# Altium schematic sheet ADC.SchDoc: Analog to Digital Conversion
size B; DrawnBy: Jasper Yun; SheetNumber: 12; SheetTotal: 13; Competition: SAC 2021; Subteam: Avionics; University: McGill University; Location: Montreal, Quebec; Project: Avionics Project Name; MRT: McGill Rocket Team
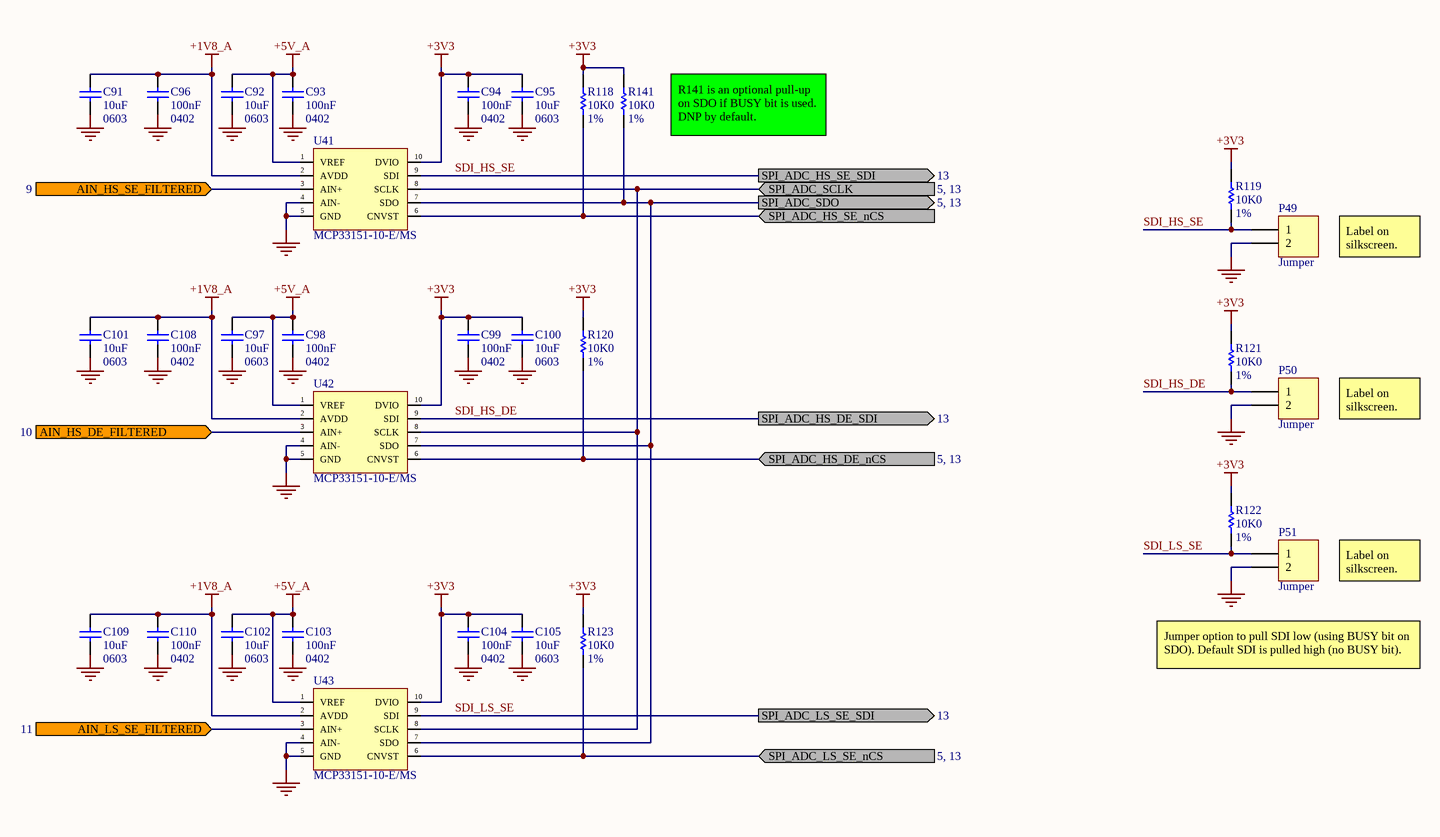
[diagram p0: ADC.SchDoc]

## Parts
C91  10uF  value 0603  [0603 CAP SAMSUNG CL10C]
C92  10uF  value 0603  [0603 CAP SAMSUNG CL10C]
C93  100nF  value 0402  [0402 CAP]
C94  100nF  value 0402  [0402 CAP]
C95  10uF  value 0603  [0603 CAP SAMSUNG CL10C]
C96  100nF  value 0402  [0402 CAP]
C97  10uF  value 0603  [0603 CAP SAMSUNG CL10C]
C98  100nF  value 0402  [0402 CAP]
C99  100nF  value 0402  [0402 CAP]
C100  10uF  value 0603  [0603 CAP SAMSUNG CL10C]
C101  10uF  value 0603  [0603 CAP SAMSUNG CL10C]
C102  10uF  value 0603  [0603 CAP SAMSUNG CL10C]
C103  100nF  value 0402  [0402 CAP]
C104  100nF  value 0402  [0402 CAP]
C105  10uF  value 0603  [0603 CAP SAMSUNG CL10C]
C108  100nF  value 0402  [0402 CAP]
C109  10uF  value 0603  [0603 CAP SAMSUNG CL10C]
C110  100nF  value 0402  [0402 CAP]
P49  Jumper  [HDR1X2]
P50  Jumper  [HDR1X2]
P51  Jumper  [HDR1X2]
R118  10K0  value 1%  [0402 RES]
R119  10K0  value 1%  [0402 RES]
R120  10K0  value 1%  [0402 RES]
R121  10K0  value 1%  [0402 RES]
R122  10K0  value 1%  [0402 RES]
R123  10K0  value 1%  [0402 RES]
R141  10K0  value 1%  [0402 RES]
U41  MCP33151-10-E/MS  [MSOP-10]
U42  MCP33151-10-E/MS  [MSOP-10]
U43  MCP33151-10-E/MS  [MSOP-10]

## Ports
AIN_HS_DE_FILTERED (in, see 10), AIN_HS_SE_FILTERED (in, see 9), AIN_LS_SE_FILTERED (in, see 11), SPI_ADC_HS_DE_nCS (in, see 5, 13), SPI_ADC_HS_DE_SDI (out, see 13), SPI_ADC_HS_SE_nCS (in), SPI_ADC_HS_SE_SDI (out, see 13), SPI_ADC_LS_SE_nCS (in, see 5, 13), SPI_ADC_LS_SE_SDI (out, see 13), SPI_ADC_SCLK (in, see 5, 13), SPI_ADC_SDO (out, see 5, 13)

## Nets
+1V8_A: C91.2 C96.2 C101.2 C108.2 C109.2 C110.2 U41.2(AVDD) U42.2(AVDD) U43.2(AVDD)
+3V3: C94.2 C95.2 C99.2 C100.2 C104.2 C105.2 R118.2 R119.2 R120.2 R121.2 R122.2 R123.2 R141.2 U41.10(DVIO) U42.10(DVIO) U43.10(DVIO)
+5V_A: C92.2 C93.2 C97.2 C98.2 C102.2 C103.2 U41.1(VREF) U42.1(VREF) U43.1(VREF)
GND: C91.1 C92.1 C93.1 C94.1 C95.1 C96.1 C97.1 C98.1 C99.1 C100.1 C101.1 C102.1 C103.1 C104.1 C105.1 C108.1 C109.1 C110.1 P49.2 P50.2 P51.2 U41.4(AIN-) U41.5(GND) U42.4(AIN-) U42.5(GND) U43.4(AIN-) U43.5(GND)
AIN_HS_DE_FILTERED: U42.3(AIN+) ; port AIN_HS_DE_FILTERED
AIN_HS_SE_FILTERED: U41.3(AIN+) ; port AIN_HS_SE_FILTERED
AIN_LS_SE_FILTERED: U43.3(AIN+) ; port AIN_LS_SE_FILTERED
SDI_HS_DE: P50.1 R121.1 U42.9(SDI) ; port SPI_ADC_HS_DE_SDI
SDI_HS_SE: P49.1 R119.1 U41.9(SDI) ; port SPI_ADC_HS_SE_SDI
SDI_LS_SE: P51.1 R122.1 U43.9(SDI) ; port SPI_ADC_LS_SE_SDI
SPI_ADC_HS_DE_nCS: R120.1 U42.6(CNVST) ; port SPI_ADC_HS_DE_nCS
SPI_ADC_HS_SE_nCS: R118.1 U41.6(CNVST) ; port SPI_ADC_HS_SE_nCS
SPI_ADC_LS_SE_nCS: R123.1 U43.6(CNVST) ; port SPI_ADC_LS_SE_nCS
SPI_ADC_SCLK: U41.8(SCLK) U42.8(SCLK) U43.8(SCLK) ; port SPI_ADC_SCLK
SPI_ADC_SDO: R141.1 U41.7(SDO) U42.7(SDO) U43.7(SDO) ; port SPI_ADC_SDO

## Notes on the sheet
- (near R141) R141 is an optional pull-up on SDO if BUSY bit is used. DNP by default.
- Label on silkscreen.
- Jumper option to pull SDI low (using BUSY bit on SDO). Default SDI is pulled high (no BUSY bit).
- Title
- Size:
- Date:
- B
- Revision:
- Time:
- Drawn By:
- Sheet
- of
- File:

## Library data of the parts
C91-C105 C108-C110 = Cap: Capacitor; Published: 8-Jun-2000; LatestRevisionDate: 17-Jul-2002; LatestRevisionNote: Re-released for DXP Platform.; PackageReference: RAD-0.3; Publisher: Altium Limited; PackageDescription: Radial Cap, Thru-Hole; 2 Leads; 0.3 in Pin Spacing
P49-P51 = Header 2: Header, 2-Pin; LatestRevisionDate: 17-Jul-2002; LatestRevisionNote: Re-released for DXP Platform.; Publisher: Altium Limited
R118-R123 R141 = Res1: Resistor; Published: 8-Jun-2000; LatestRevisionDate: 17-Jul-2002; LatestRevisionNote: Re-released for DXP Platform.; PackageReference: AXIAL-0.3; Publisher: Altium Limited; PackageDescription: Axial Device, Thru-Hole; 2 Leads; 0.3 in Pin Spacing
U41-U43 = ADC MCP33151: ADC 14-bit SAR 1Msps 10-MSOP; Manufacturer: Microchip; Supplier 1: Arrow Electronics; Manufacturer Part Number: MCP33151-10-E/MS; RoHS: No; Category: Analog to Digital Converters (ADCs); Stock 1: 90; Pricing 1: 1=2.20600 (USD); Supplier Part Number 1: MCP33151-10-E/MS